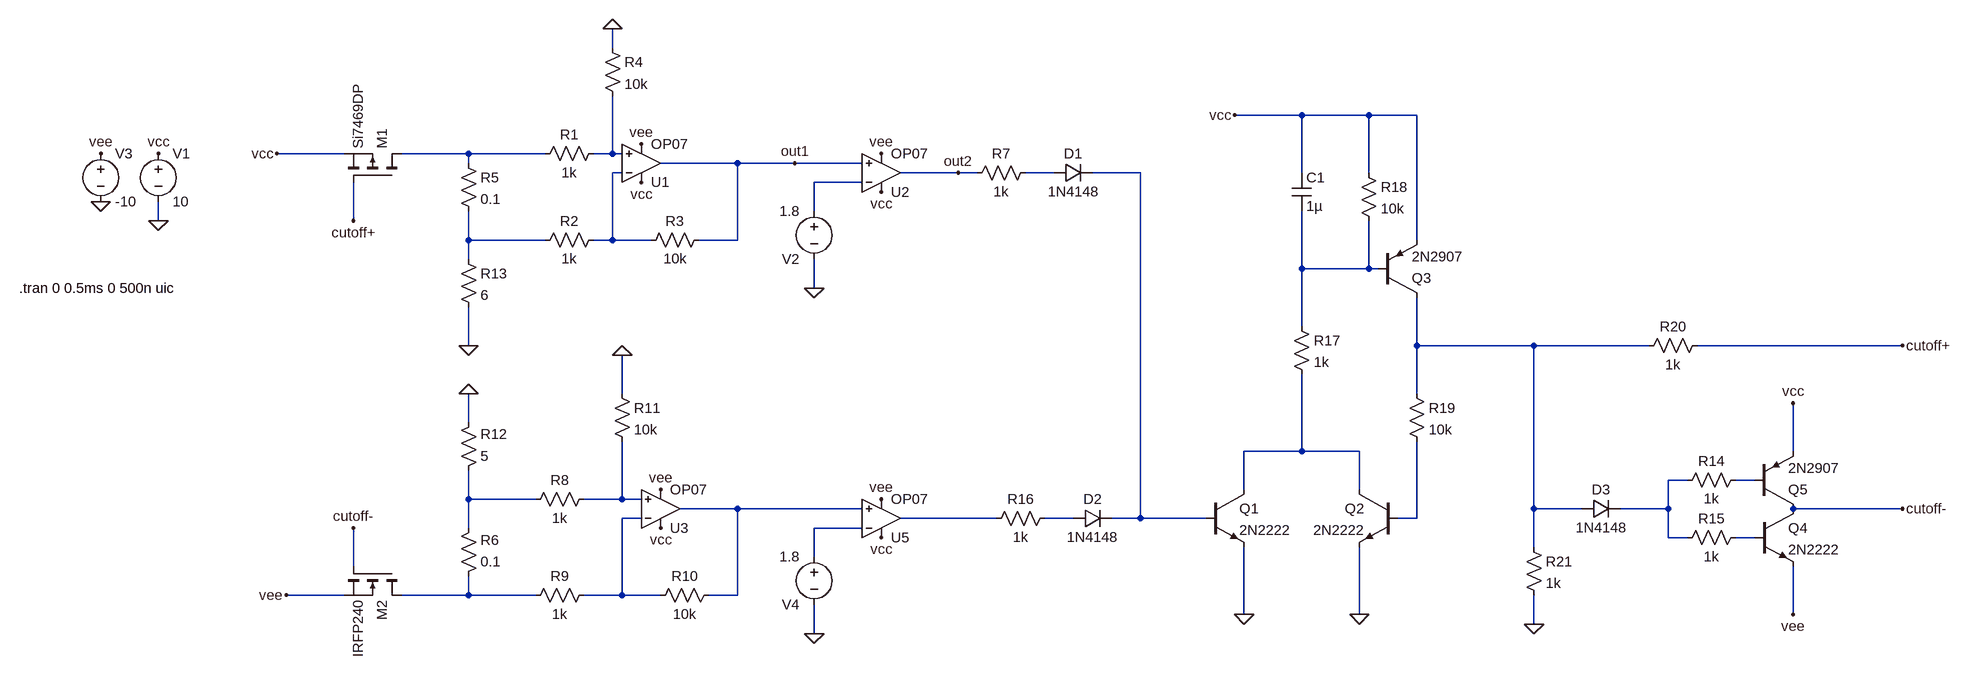
[diagram p0: schematic latching.asc]
latching.asc, the LTspice schematic file:
Version 4
SHEET 1 3920 1224
WIRE 144 -64 144 -96
WIRE 1296 48 1184 48
WIRE 1408 48 1296 48
WIRE 1488 48 1408 48
WIRE -304 112 -416 112
WIRE -96 112 -208 112
WIRE 32 112 -96 112
WIRE 144 112 144 16
WIRE 144 112 112 112
WIRE 160 112 144 112
WIRE -96 128 -96 112
WIRE 352 128 224 128
WIRE 448 128 352 128
WIRE 560 128 448 128
WIRE 160 144 144 144
WIRE 720 144 624 144
WIRE 752 144 720 144
WIRE 880 144 832 144
WIRE 1024 144 944 144
WIRE 1296 144 1296 48
WIRE 1408 144 1408 48
WIRE 560 160 480 160
WIRE 480 208 480 160
WIRE -880 224 -880 192
WIRE -288 224 -288 160
WIRE -96 256 -96 208
WIRE 32 256 -96 256
WIRE 144 256 144 144
WIRE 144 256 112 256
WIRE 208 256 144 256
WIRE 352 256 352 128
WIRE 352 256 288 256
WIRE 1488 256 1488 48
WIRE -96 288 -96 256
WIRE 1296 304 1296 208
WIRE 1408 304 1408 224
WIRE 1408 304 1296 304
WIRE 1424 304 1408 304
WIRE 480 336 480 288
WIRE 1296 400 1296 304
WIRE -96 432 -96 368
WIRE 1488 432 1488 352
WIRE 1840 432 1488 432
WIRE 2032 432 1840 432
WIRE 2496 432 2112 432
WIRE 160 512 160 448
WIRE 1488 512 1488 432
WIRE -96 560 -96 512
WIRE 1296 608 1296 480
WIRE 1296 608 1200 608
WIRE 1392 608 1296 608
WIRE 2272 608 2272 528
WIRE 2096 656 2064 656
WIRE 2208 656 2176 656
WIRE 1200 672 1200 608
WIRE 1392 672 1392 608
WIRE -96 688 -96 640
WIRE 16 688 -96 688
WIRE 160 688 160 592
WIRE 160 688 96 688
WIRE 192 688 160 688
WIRE 352 704 256 704
WIRE 560 704 352 704
WIRE 1840 704 1840 432
WIRE 1920 704 1840 704
WIRE 2064 704 2064 656
WIRE 2064 704 1984 704
WIRE 2496 704 2272 704
WIRE 192 720 160 720
WIRE 784 720 624 720
WIRE 912 720 864 720
WIRE 1024 720 1024 144
WIRE 1024 720 976 720
WIRE 1136 720 1024 720
WIRE 1488 720 1488 592
WIRE 1488 720 1456 720
WIRE -96 736 -96 688
WIRE 560 736 480 736
WIRE 2064 752 2064 704
WIRE 2096 752 2064 752
WIRE 2208 752 2176 752
WIRE 1840 768 1840 704
WIRE 480 784 480 736
WIRE -288 800 -288 736
WIRE -304 848 -400 848
WIRE -96 848 -96 816
WIRE -96 848 -208 848
WIRE 16 848 -96 848
WIRE 160 848 160 720
WIRE 160 848 96 848
WIRE 224 848 160 848
WIRE 352 848 352 704
WIRE 352 848 304 848
WIRE 1200 880 1200 768
WIRE 1392 880 1392 768
WIRE 2272 880 2272 800
WIRE 1840 896 1840 848
WIRE 480 912 480 864
FLAG -880 224 0
FLAG -880 112 vcc
FLAG 192 160 vcc
FLAG -416 112 vcc
FLAG -96 432 0
FLAG 592 176 vcc
FLAG 480 336 0
FLAG 144 -96 0
FLAG -976 112 vee
FLAG -976 192 0
FLAG 448 128 out1
FLAG 720 144 out2
FLAG 592 112 vee
FLAG 192 96 vee
FLAG -96 512 0
FLAG 224 672 vee
FLAG 224 736 vcc
FLAG -400 848 vee
FLAG 480 912 0
FLAG 592 752 vcc
FLAG 592 688 vee
FLAG 1392 880 0
FLAG 1184 48 vcc
FLAG -288 224 cutoff+
FLAG 2496 432 cutoff+
FLAG 1840 896 0
FLAG -288 736 cutoff-
FLAG 160 448 0
FLAG 1200 880 0
FLAG 2272 528 vcc
FLAG 2272 880 vee
FLAG 2496 704 cutoff-
SYMBOL res 128 240 R90
WINDOW 0 0 56 VBottom 2
WINDOW 3 32 56 VTop 2
SYMATTR InstName R2
SYMATTR Value 1k
SYMBOL res 128 96 R90
WINDOW 0 0 56 VBottom 2
WINDOW 3 32 56 VTop 2
SYMATTR InstName R1
SYMATTR Value 1k
SYMBOL res 304 240 R90
WINDOW 0 0 56 VBottom 2
WINDOW 3 32 56 VTop 2
SYMATTR InstName R3
SYMATTR Value 10k
SYMBOL res 128 -80 R0
SYMATTR InstName R4
SYMATTR Value 10k
SYMBOL voltage -880 96 R0
WINDOW 123 0 0 Left 0
WINDOW 39 0 0 Left 0
SYMATTR InstName V1
SYMATTR Value 10
SYMBOL res -112 112 R0
SYMATTR InstName R5
SYMATTR Value 0.1
SYMBOL voltage 480 192 M0
WINDOW 0 24 96 Left 2
WINDOW 3 24 16 Left 2
WINDOW 123 0 0 Left 0
WINDOW 39 0 0 Left 0
SYMATTR InstName V2
SYMATTR Value 1.8
SYMBOL voltage -976 96 R0
WINDOW 123 0 0 Left 0
WINDOW 39 0 0 Left 0
SYMATTR InstName V3
SYMATTR Value -10
SYMBOL res 736 160 R270
WINDOW 0 32 56 VTop 2
WINDOW 3 0 56 VBottom 2
SYMATTR InstName R7
SYMATTR Value 1k
SYMBOL res -112 272 R0
SYMATTR InstName R13
SYMATTR Value 6
SYMBOL OpAmps\\OP07 192 192 M180
SYMATTR InstName U1
SYMBOL OpAmps\\OP07 592 208 M180
SYMATTR InstName U2
SYMBOL res -112 832 M180
WINDOW 0 36 76 Left 2
WINDOW 3 36 40 Left 2
SYMATTR InstName R6
SYMATTR Value 0.1
SYMBOL res 112 672 R90
WINDOW 0 0 56 VBottom 2
WINDOW 3 32 56 VTop 2
SYMATTR InstName R8
SYMATTR Value 1k
SYMBOL res 112 832 R90
WINDOW 0 0 56 VBottom 2
WINDOW 3 32 56 VTop 2
SYMATTR InstName R9
SYMATTR Value 1k
SYMBOL res 320 832 R90
WINDOW 0 0 56 VBottom 2
WINDOW 3 32 56 VTop 2
SYMATTR InstName R10
SYMATTR Value 10k
SYMBOL res 144 496 R0
SYMATTR InstName R11
SYMATTR Value 10k
SYMBOL OpAmps\\OP07 224 768 M180
SYMATTR InstName U3
SYMBOL res -112 656 M180
WINDOW 0 36 76 Left 2
WINDOW 3 36 40 Left 2
SYMATTR InstName R12
SYMATTR Value 5
SYMBOL OpAmps\\OP07 592 784 M180
SYMATTR InstName U5
SYMBOL voltage 480 768 M0
WINDOW 0 24 96 Left 2
WINDOW 3 24 16 Left 2
WINDOW 123 0 0 Left 0
WINDOW 39 0 0 Left 0
SYMATTR InstName V4
SYMATTR Value 1.8
SYMBOL res 880 704 R90
WINDOW 0 0 56 VBottom 2
WINDOW 3 32 56 VTop 2
SYMATTR InstName R16
SYMATTR Value 1k
SYMBOL diode 880 160 R270
WINDOW 0 32 32 VTop 2
WINDOW 3 0 32 VBottom 2
SYMATTR InstName D1
SYMATTR Value 1N4148
SYMBOL diode 912 736 R270
WINDOW 0 32 32 VTop 2
WINDOW 3 0 32 VBottom 2
SYMATTR InstName D2
SYMATTR Value 1N4148
SYMBOL npn 1136 672 R0
SYMATTR InstName Q1
SYMATTR Value 2N2222
SYMBOL npn 1456 672 M0
SYMATTR InstName Q2
SYMATTR Value 2N2222
SYMBOL res 1280 384 R0
SYMATTR InstName R17
SYMATTR Value 1k
SYMBOL res 1392 128 R0
SYMATTR InstName R18
SYMATTR Value 10k
SYMBOL res 1472 496 R0
SYMATTR InstName R19
SYMATTR Value 10k
SYMBOL pnp 1424 352 M180
SYMATTR InstName Q3
SYMATTR Value 2N2907
SYMBOL cap 1280 144 R0
SYMATTR InstName C1
SYMATTR Value 1µ
SYMBOL pmos -208 160 M270
SYMATTR InstName M1
SYMATTR Value Si7469DP
SYMBOL res 1824 752 R0
SYMATTR InstName R21
SYMATTR Value 1k
SYMBOL res 2016 448 R270
WINDOW 0 32 56 VTop 2
WINDOW 3 0 56 VBottom 2
SYMATTR InstName R20
SYMATTR Value 1k
SYMBOL nmos -208 800 R90
SYMATTR InstName M2
SYMATTR Value IRFP240
SYMBOL diode 1920 720 R270
WINDOW 0 32 32 VTop 2
WINDOW 3 0 32 VBottom 2
SYMATTR InstName D3
SYMATTR Value 1N4148
SYMBOL npn 2208 704 R0
SYMATTR InstName Q4
SYMATTR Value 2N2222
SYMBOL pnp 2208 704 M180
SYMATTR InstName Q5
SYMATTR Value 2N2907
SYMBOL res 2192 640 R90
WINDOW 0 0 56 VBottom 2
WINDOW 3 32 56 VTop 2
SYMATTR InstName R14
SYMATTR Value 1k
SYMBOL res 2192 736 R90
WINDOW 0 0 56 VBottom 2
WINDOW 3 32 56 VTop 2
SYMATTR InstName R15
SYMATTR Value 1k
TEXT -1112 336 Left 2 !.tran 0 0.5ms 0 500n uic

The netlist it stands for:
* latching.asc
R2 N003 N007 1k
R1 N002 N001 1k
R3 out1 N003 10k
R4 0 N002 10k
V1 vcc 0 10
R5 N001 N007 0.1
V2 N006 0 1.8
V3 vee 0 -10
R7 out2 N004 1k
R13 N007 0 6
XU1 N002 N003 vcc vee out1 LT1001  ; OP07, pins In+ In- V+ V- OUT
XU2 out1 N006 vcc vee out2 LT1001  ; OP07, pins In+ In- V+ V- OUT
R6 N022 N013 0.1
R8 N014 N013 1k
R9 N016 N022 1k
R10 N015 N016 10k
R11 0 N014 10k
XU3 N014 N016 vcc vee N015 LT1001  ; OP07, pins In+ In- V+ V- OUT
R12 N013 0 5
XU5 N015 N020 vcc vee N017 LT1001  ; OP07, pins In+ In- V+ V- OUT
V4 N020 0 1.8
R16 N018 N017 1k
D1 N004 N005 1N4148
D2 N018 N005 1N4148
Q1 N010 N005 0 0 2N2222
Q2 N010 N019 0 0 2N2222
R17 N008 N010 1k
R18 vcc N008 10k
R19 N009 N019 10k
Q3 N009 N008 vcc 0 2N2907
C1 vcc N008 1µ
M1 N001 cutoff+ vcc vcc Si7469DP
R21 N009 0 1k
R20 N009 cutoff+ 1k
M2 N022 cutoff- vee vee IRFP240
D3 N009 N011 1N4148
Q4 cutoff- N021 vee 0 2N2222
Q5 cutoff- N012 vcc 0 2N2907
R14 N012 N011 1k
R15 N021 N011 1k
.model D D
.lib standard.dio
.model NPN NPN
.model PNP PNP
.lib standard.bjt
.model NMOS NMOS
.model PMOS PMOS
.lib standard.mos
.tran 0 0.5ms 0 500n uic
.lib LTC.lib
.backanno
.end